# EAGLE design DOUBLE MOTOR 3 (EAGLE 6.6.0)
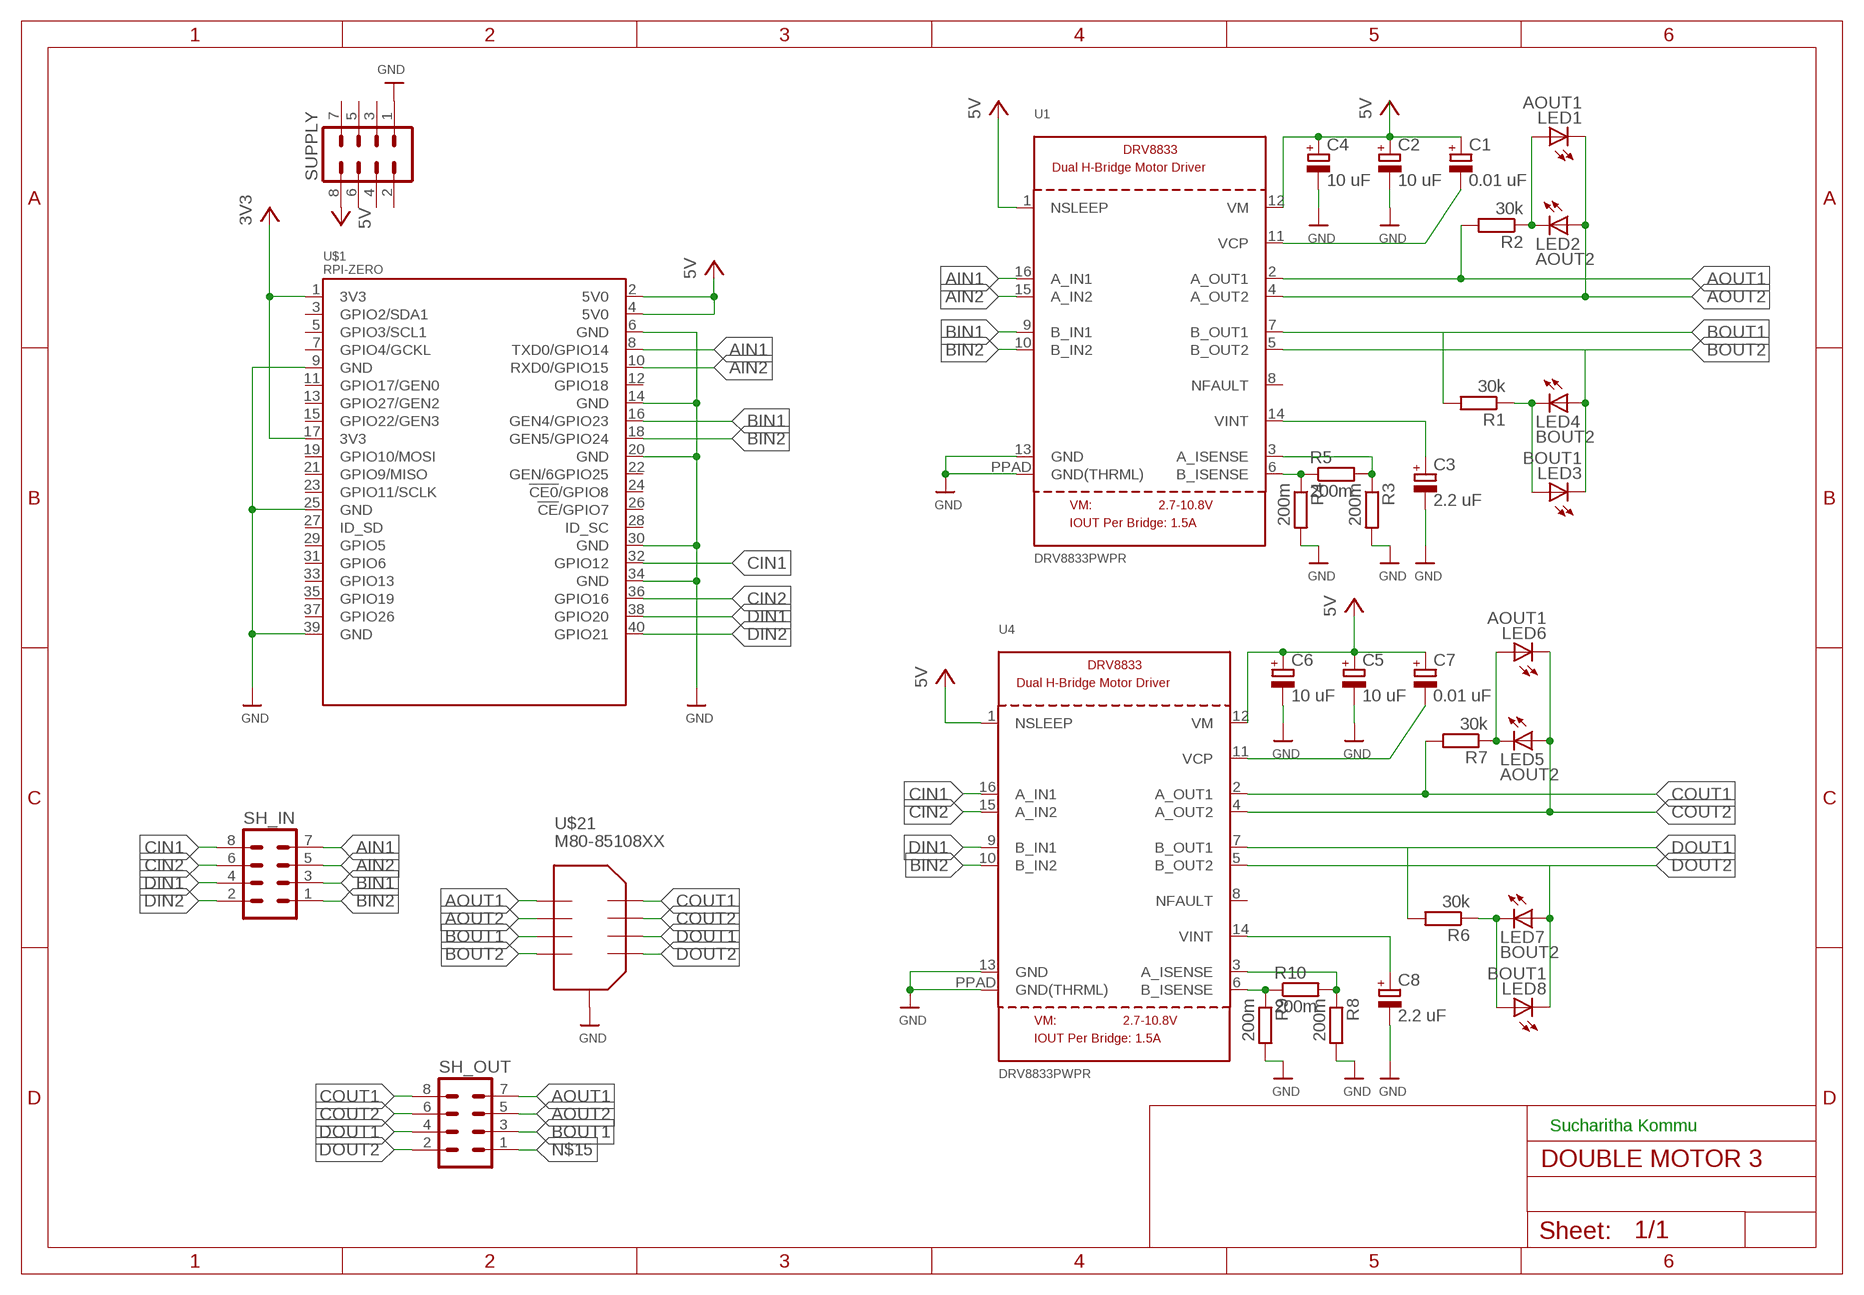
[diagram p0: schematic, sheet 1]

## Parts
C1  0.01 uF  CPOL-EUSMCC  [SMC_C]
C2  10 uF  CPOL-EUE2.5-6  [E2,5-6]
C3  2.2 uF  CPOL-EUSMCC  [SMC_C]
C4  10 uF  CPOL-EUE3.5-8  [E3,5-8]
C5  10 uF  CPOL-EUE2.5-6  [E2,5-6]
C6  10 uF  CPOL-EUE3.5-8  [E3,5-8]
C7  0.01 uF  CPOL-EUSMCC  [SMC_C]
C8  2.2 uF  CPOL-EUSMCC  [SMC_C]
LED1  AOUT1  LED5MM  [LED5MM]
LED2  AOUT2  LED5MM  [LED5MM]
LED3  BOUT1  LED5MM  [LED5MM]
LED4  BOUT2  LED5MM  [LED5MM]
LED5  AOUT2  LED5MM  [LED5MM]
LED6  AOUT1  LED5MM  [LED5MM]
LED7  BOUT2  LED5MM  [LED5MM]
LED8  BOUT1  LED5MM  [LED5MM]
R1  30k  R-EU_0204/2V  [0204V]
R2  30k  R-EU_0204/2V  [0204V]
R3  200m  R-EU_0204/2V  [0204V]
R4  200m  R-EU_0204/2V  [0204V]
R5  200m  R-EU_0204/2V  [0204V]
R6  30k  R-EU_0204/2V  [0204V]
R7  30k  R-EU_0204/2V  [0204V]
R8  200m  R-EU_0204/2V  [0204V]
R9  200m  R-EU_0204/2V  [0204V]
R10  200m  R-EU_0204/2V  [0204V]
SH_IN  MA04-2  [MA04-2]
SH_OUT  MA04-2  [MA04-2]
SUPPLY  MA04-2  [MA04-2]
U1  DRV8833PWPR  DRV8833  [HTSSOP16]
U4  DRV8833PWPR  DRV8833  [HTSSOP16]
U$1  RPI-ZERO  [RASPBERRYPI_BASTELSTUBE_V13_RASPI_BOARD_B+_FULL]
U$21  M80-85108XX  [M80-85108XX]

## Nets
3V3: U$1.1(3V3) U$1.17(3V3)
5V: U$1.2(5V0) U$1.4(5V0)
AIN1: SH_IN.7 U1.16(A_IN1) U$1.8(TXD0/GPIO14)
AIN2: SH_IN.5 U1.15(A_IN2) U$1.10(RXD0/GPIO15)
AOUT1: R2.2 SH_OUT.7 U1.2(A_OUT1) U$21.P$5
AOUT2: LED1.K(C) LED2.A SH_OUT.5 U1.4(A_OUT2) U$21.P$7
BIN1: SH_IN.3 U1.9(B_IN1) U$1.16(GEN4/GPIO23)
BIN2: SH_IN.1 U1.10(B_IN2) U4.10(B_IN2) U$1.18(GEN5/GPIO24)
BOUT1: R1.2 SH_OUT.3 U1.7(B_OUT1) U$21.P$9
BOUT2: LED3.K(C) LED4.A U1.5(B_OUT2) U$21.P$11
CIN1: SH_IN.8 U4.16(A_IN1) U$1.32(GPIO12)
CIN2: SH_IN.6 U4.15(A_IN2) U$1.36(GPIO16)
COUT1: R7.2 SH_OUT.8 U4.2(A_OUT1) U$21.P$6
COUT2: LED5.A LED6.K(C) SH_OUT.6 U4.4(A_OUT2) U$21.P$8
DIN1: SH_IN.4 U4.9(B_IN1) U$1.38(GPIO20)
DIN2: SH_IN.2 U$1.40(GPIO21)
DOUT1: R6.2 SH_OUT.4 U4.7(B_OUT1) U$21.P$10
DOUT2: LED7.A LED8.K(C) SH_OUT.2 U4.5(B_OUT2) U$21.P$12
GND: C1.- C2.- C3.- C4.- C5.- C6.- C7.- C8.- R3.2 R4.2 R8.2 R9.2 SUPPLY.1 U1.11(VCP) U1.13(GND) U1.PPAD(GND(THRML)) U4.11(VCP) U4.13(GND) U4.PPAD(GND(THRML)) U$1.6(GND) U$1.9(GND) U$1.14(GND) U$1.20(GND) U$1.25(GND) U$1.30(GND) U$1.34(GND) U$1.39(GND) U$21.COMMON1(COMMON) U$21.COMMON2(COMMON) U$21.COMMON3(COMMON) U$21.COMMON4(COMMON)
N$1: LED7.K(C) LED8.A R6.1
N$2: LED5.K(C) LED6.A R7.1
N$3: R8.1 R10.2 U4.3(A_ISENSE)
N$4: C8.+ U4.14(VINT)
N$5: LED1.A LED2.K(C) R2.1
N$6: R9.1 R10.1 U4.6(B_ISENSE)
N$7: LED3.A LED4.K(C) R1.1
N$11: C3.+ U1.14(VINT)
N$12: R3.1 R5.2 U1.3(A_ISENSE)
N$13: R4.1 R5.1 U1.6(B_ISENSE)
N$15: SH_OUT.1
VCC: C1.+ C2.+ C4.+ C5.+ C6.+ C7.+ SUPPLY.8 U1.1(NSLEEP) U1.12(VM) U4.1(NSLEEP) U4.12(VM) ; supply symbol labelled 5V
Unconnected: SUPPLY.2 SUPPLY.3 SUPPLY.4 SUPPLY.5 SUPPLY.6 SUPPLY.7 U1.8(NFAULT) U4.8(NFAULT) U$1.3(GPIO2/SDA1) U$1.5(GPIO3/SCL1) U$1.7(GPIO4/GCKL) U$1.11(GPIO17/GEN0) U$1.12(GPIO18) U$1.13(GPIO27/GEN2) U$1.15(GPIO22/GEN3) U$1.19(GPIO10/MOSI) U$1.21(GPIO9/MISO) U$1.22(GEN/6GPIO25) U$1.23(GPIO11/SCLK) U$1.24(!CE0!/GPIO8) U$1.26(!CE!/GPIO7) U$1.27(ID_SD) U$1.28(ID_SC) U$1.29(GPIO5) U$1.31(GPIO6) U$1.33(GPIO13) U$1.35(GPIO19) U$1.37(GPIO26)

## Notes on the sheet
- Sucharitha Kommu

## Library data of the parts
C1 C3 C7 C8 = resistor:CPOL-EU: POLARIZED CAPACITOR, European symbol
C2 C4-C6 = rcl:CPOL-EU: POLARIZED CAPACITOR, European symbol
LED1-LED8 = led:LED: LED OSRAM: - CHIPLED LG R971, LG N971, LY N971, LG Q971, LY Q971, LO R971, LY R971 LH N974, LH R974 LS Q976, LO Q976, LY Q976 LO Q996 - Hyper CHIPLED LW Q18S LB Q993, LB Q99A, LB R99A - SideLED LS A670, LO A670, LY A670, LG A670, LP A670 LB A673, LV A673, LT A673, LW A673 LH A674 LY A675 LS A676, LA A676, LO A676, LY A676, LW A676 LS A679, LY A679, LG A679 - Hyper Micro SIDELED® LS Y876, LA Y876, LO Y876, LY Y876 LT Y87S - SmartLED LW L88C, LW L88S LB L89C, LB L89S, LG L890 LS L89K, LO L89K, LY L89K LS L896, LA L896, LO L896, LY L896 - TOPLED LS T670, LO T670, LY T670, LG T670, LP T670 LSG T670, LSP T670, LSY T670, LOP T670, LYG T670 LG T671, LOG T671, LSG T671 LB T673, LV T673, LT T673, LW T673 LH T674 LS T676, LA T676, LO T676, LY T676, LB T676, LH T676, LSB T676, LW T676 LB T67C, LV T67C, LT T67C, LS T67K, LO T67K, LY T67K, LW E67C LS E67B, LA E67B, LO E67B, LY E67B, LB E67C, LV E67C, LT E67C LW T67C LS T679, LY T679, LG T679 LS T770, LO T770, LY T770, LG T770, LP T770 LB T773, LV T773, LT T773, LW T773 LH T774 LS E675, LA E675, LY E675, LS T675 LS T776, LA T776, LO T776, LY T776, LB T776 LHGB T686 LT T68C, LB T68C - Hyper Mini TOPLED® LB M676 - Mini TOPLED Santana® LG M470 LS M47K, LO M47K, LY M47K Source: http://www.osram.convergy.de LUXEON: - LUMILED® LXK2-PW12-R00, LXK2-PW12-S00, LXK2-PW14-U00, LXK2-PW14-V00 LXK2-PM12-R00, LXK2-PM12-S00, LXK2-PM14-U00 LXK2-PE12-Q00, LXK2-PE12-R00, LXK2-PE12-S00, LXK2-PE14-T00, LXK2-PE14-U00 LXK2-PB12-K00, LXK2-PB12-L00, LXK2-PB12-M00, LXK2-PB14-N00, LXK2-PB14-P00, LXK2-PB14-Q00 LXK2-PR12-L00, LXK2-PR12-M00, LXK2-PR14-Q00, LXK2-PR14-R00 LXK2-PD12-Q00, LXK2-PD12-R00, LXK2-PD12-S00 LXK2-PH12-R00, LXK2-PH12-S00 LXK2-PL12-P00, LXK2-PL12-Q00, LXK2-PL12-R00 Source: www.luxeon.com KINGBRIGHT: KA-3528ASYC Source: www.kingbright.com
R1-R10 = rcl:R-EU_: RESISTOR, European symbol
SH_IN SH_OUT SUPPLY = con-lstb:MA04-2: PIN HEADER; OC_FARNELL: unknown; OC_NEWARK: unknown
U1 U4 = microbuilder:DRV8833: DRV8833 Dual H-Bridge Motor Driver -- HTSSOP Package
U$1 = RPI-Zero:RPI-ZERO
U$21 = Harwin:M80-85108XX

## Board
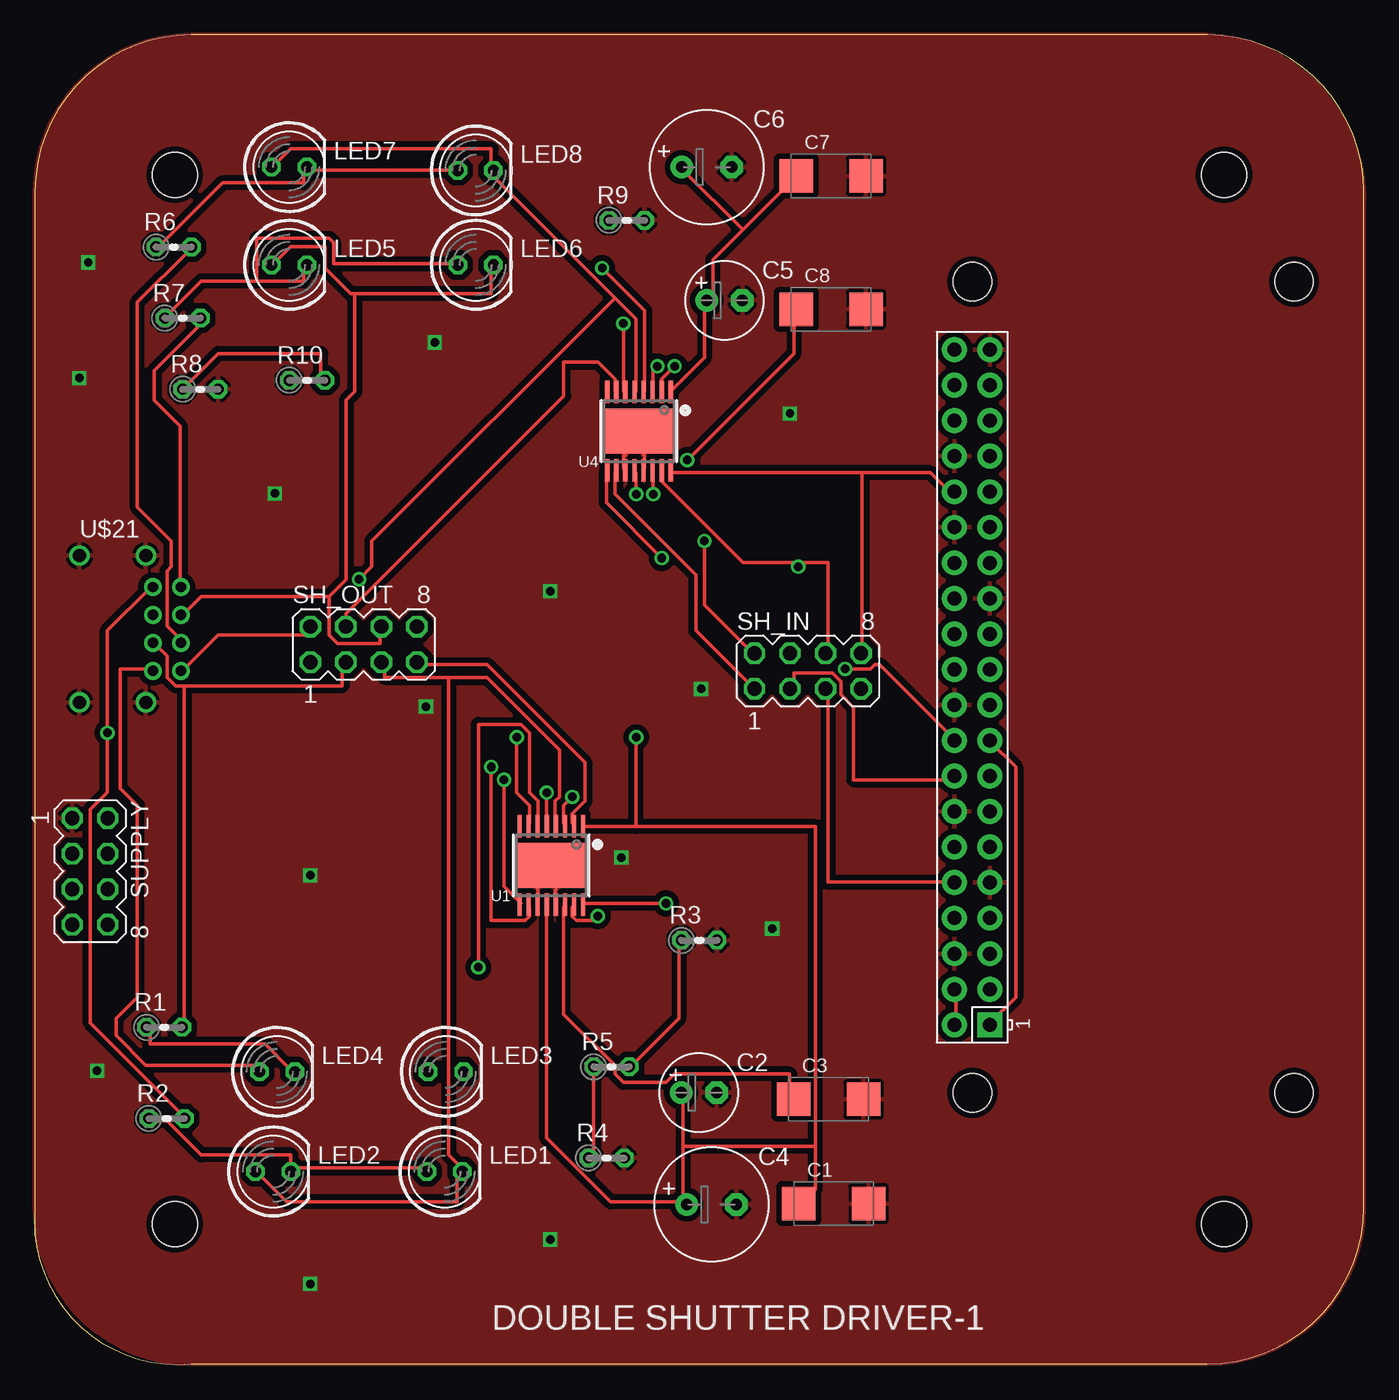
[diagram p1: board, top side]
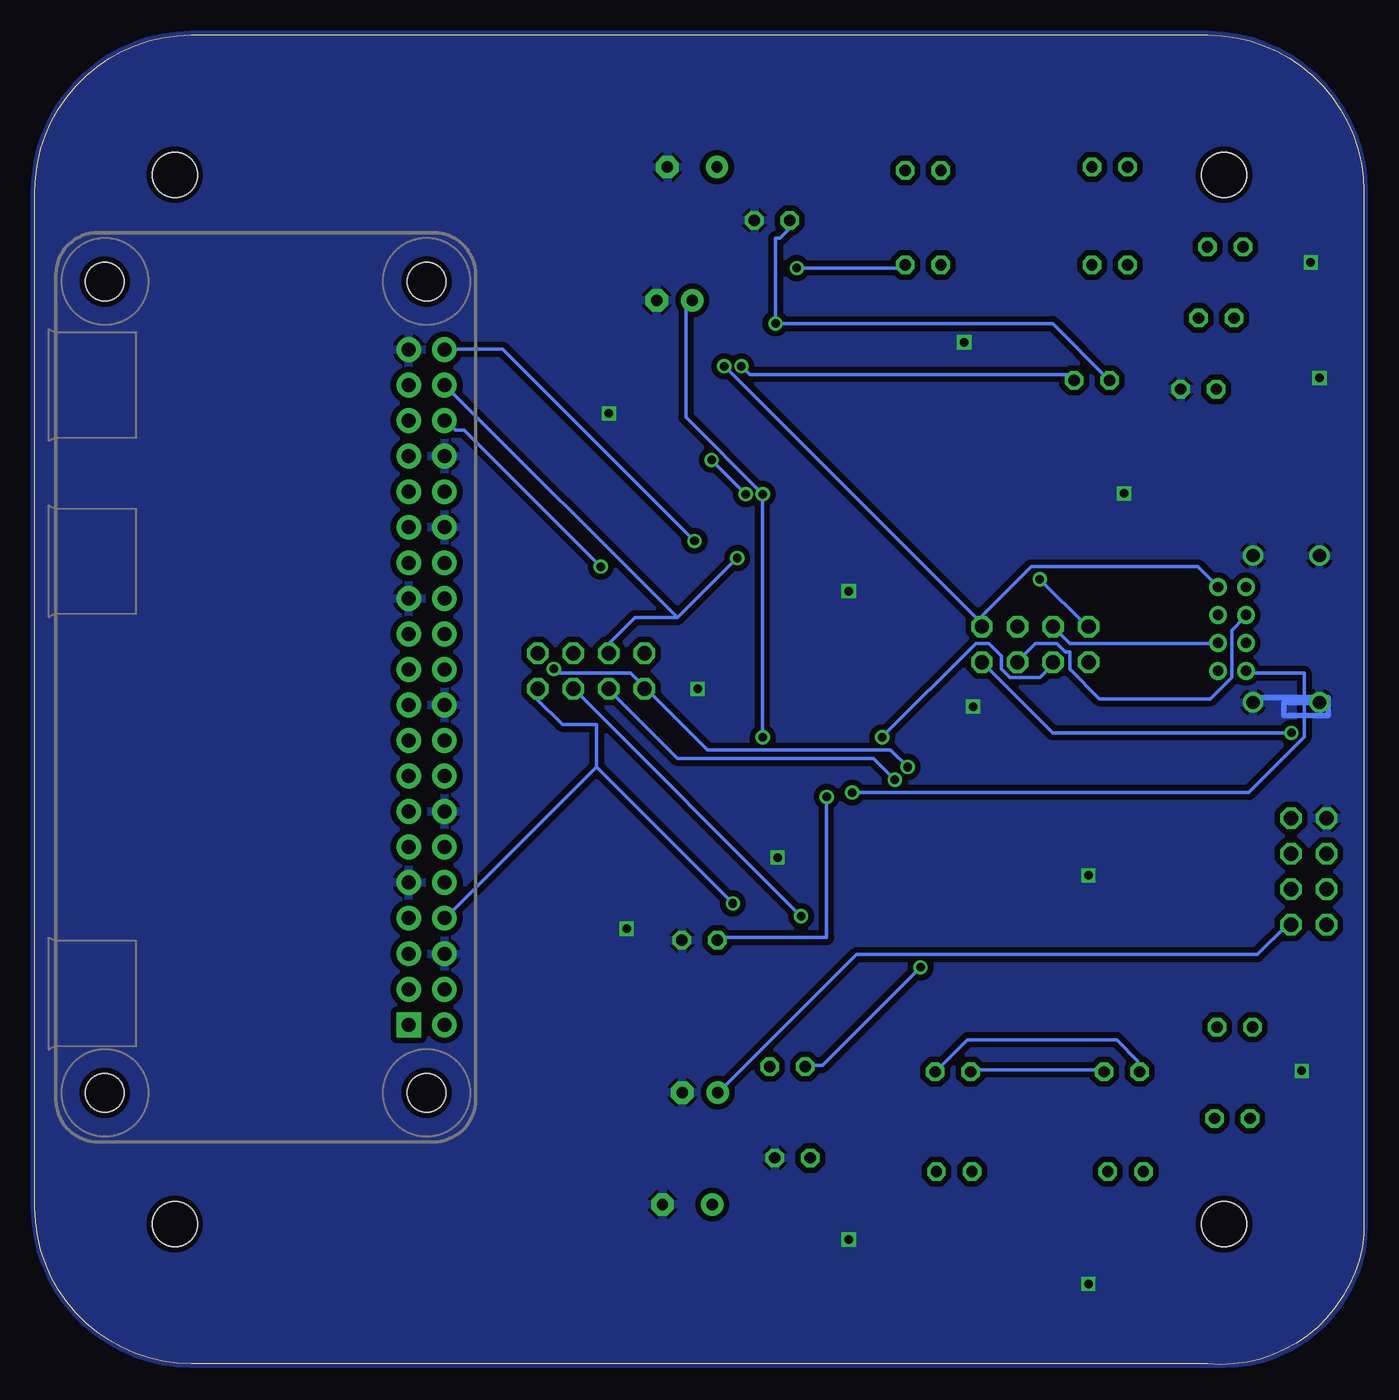
[diagram p2: board, bottom side, seen from below]

Size 95 x 95.04 mm. Coordinates in mm from the lower left corner, seen from the top.
Outline: 83.82,95.04 11.18,95.04 arc90 0,83.86 0,9.32 arc90 11.18,0.04 83.82,0.04 arc90 95,11.22 95,83.86 arc90 83.82,95.04
Copper layers (1*16): Top 0.035mm / dielectric 1.5mm / Bottom 0.035mm
Design rules "default *": minimum track width 10mil, minimum drill 24mil, track to track 8mil, track to pad 8mil, pad to pad 8mil, via to via 8mil, smd to smd 8mil, copper to edge 0mil, drill to drill 8mil, minimum pad ring 10mil, minimum via ring 8mil, stop-mask expansion 4mil, vias tented up to drill 0mil, thermal gap 10mil
Holes 3.2 mm at 10,85.04 10,10.04 85,10.04 85,85.04

### Footprints (pad centres in the part's own frame; a part is rotated, then mirrored left to right if it is on the bottom)
SMC_C = smd 2.4 x 2.4: + -2.5,0; - 2.5,0
E2,5-6 = drill 0.813 pad 1.6: + -1.27,0 | drill 0.813 pad 1.6 octagon: - 1.27,0
E3,5-8 = drill 0.813 pad 1.6: + -1.778,0 | drill 0.813 pad 1.6 octagon: - 1.778,0
LED5MM = drill 0.813 octagon: A -1.27,0; K 1.27,0
0204V = drill 0.813 octagon: 1 -1.27,0; 2 1.27,0
MA04-2 = drill 1.016 octagon: 1 -3.81,-1.27; 2 -3.81,1.27; 3 -1.27,-1.27; 4 -1.27,1.27; 5 1.27,-1.27; 6 1.27,1.27; 7 3.81,-1.27; 8 3.81,1.27
HTSSOP16 = smd 0.3 x 1.6: 1 -2.275,-2.8; 2 -1.625,-2.8; 3 -0.975,-2.8; 4 -0.325,-2.8; 5 0.325,-2.8; 6 0.975,-2.8; 7 1.625,-2.8; 8 2.275,-2.8; 9 2.275,2.8; 10 1.625,2.8; 11 0.975,2.8; 12 0.325,2.8; 13 -0.325,2.8; 14 -0.975,2.8; 15 -1.625,2.8; 16 -2.275,2.8 | smd 4.8 x 3.2: PPAD 0,0
RASPBERRYPI_BASTELSTUBE_V13_RASPI_BOARD_B+_FULL = drill 1 pad 1.778 square: 1 8.37,25.23 | drill 1 pad 1.778: 2 8.37,27.77; 3 10.91,25.23; 4 10.91,27.77; 5 13.45,25.23; 6 13.45,27.77; 7 15.99,25.23; 8 15.99,27.77; 9 18.53,25.23; 10 18.53,27.77; 11 21.07,25.23; 12 21.07,27.77; 13 23.61,25.23; 14 23.61,27.77; 15 26.15,25.23; 16 26.15,27.77; 17 28.69,25.23; 18 28.69,27.77; 19 31.23,25.23; 20 31.23,27.77; 21 33.77,25.23; 22 33.77,27.77; 23 36.31,25.23; 24 36.31,27.77; 25 38.85,25.23; 26 38.85,27.77; 27 41.39,25.23; 28 41.39,27.77; 29 43.93,25.23; 30 43.93,27.77; 31 46.47,25.23; 32 46.47,27.77; 33 49.01,25.23; 34 49.01,27.77; 35 51.55,25.23; 36 51.55,27.77; 37 54.09,25.23; 38 54.09,27.77; 39 56.63,25.23; 40 56.63,27.77 | hole 2.75: 3.5,3.5; 3.5,26.5; 61.5,3.5; 61.5,26.5
M80-85108XX = drill 0.95: COMMON1 0,0; COMMON2 0,4.75; COMMON3 10.5,0; COMMON4 10.5,4.75 | drill 0.75: P$5 2.25,5.25; P$6 2.25,7.25; P$7 4.25,5.25; P$8 4.25,7.25; P$9 6.25,5.25; P$10 6.25,7.25; P$11 8.25,5.25; P$12 8.25,7.25

### Placement (x,y rotation side)
C1  57.09,11.5 0 top
C2  47.46,19.44 0 top
C3  56.73,18.96 0 top
C4  48.37,11.44 0 top
C5  49.29,76.07 0 top
C6  48.02,85.6 0 top
C7  56.91,84.96 0 top
C8  56.91,75.44 0 top
LED1  29.29,13.8 0 top
LED2  17.04,13.8 0 top
LED3  29.37,20.92 0 top
LED4  17.3,20.92 0 top
LED5  18.18,78.61 0 top
LED6  31.51,78.61 0 top
LED7  18.18,85.6 0 top
LED8  31.51,85.36 0 top
R1  9.24,24.11 0 top
R2  9.41,17.59 0 top
R3  47.48,30.33 0 top
R4  40.84,14.77 0 top
R5  41.21,21.28 0 top
R6  9.92,79.88 0 top
R7  10.55,74.8 0 top
R8  11.82,69.72 0 top
R9  42.3,81.79 0 top
R10  19.45,70.36 0 top
SH_IN  55.24,49.57 0 top
SH_OUT  23.5,51.48 0 top
SUPPLY  3.94,35.25 270 top
U1  36.91,35.68 180 top
U4  43.18,66.72 180 top
U$1  93.5,15.92 90 top
U$21  3.17,57.83 270 top

### Tracks (layer width: path | path; a pad name or v marks a point on that pad's centre or on a via)
3V3
  Top 0.254: U$1.1 68.28,24.43 70.1,26.26 70.1,42.72 68.28,44.55 U$1.17
5V
  Top 0.254: U$1.2 65.84,24.43 65.84,26.56 U$1.4
AIN1  (via drill 0.61)
  Top 0.254: v45.11,32.96 39.32,32.96 U1.16
  Bottom 0.254: 54.86,42.72 65.53,32.05 U$1.8 | 54.86,42.72 54.86,45.76 57.3,45.76 59.13,47.59 59.13,48.2 SH_IN.7 | 54.86,42.72 v45.11,32.96
AIN2  (via drill 0.61)
  Top 0.254: v40.23,32.05 40.23,31.74 38.71,31.74 38.41,32.05 38.41,32.66 U1.15 | U$1.10 65.53,34.49 56.69,34.49 56.69,48.2 SH_IN.5
  Bottom 0.254: v40.23,32.05 56.39,48.2 SH_IN.5
AOUT1  (via drill 0.61)
  Top 0.254: U$21.P$5 8.23,55.52 5.18,52.47 v5.18,45.15 5.18,40.89 3.96,39.67 3.96,24.43 10.67,17.72 R2.2 | U1.2 38.41,38.75 38.41,39.36 39.32,40.28 39.32,43.02 32.31,50.03 27.43,50.03 SH_OUT.7
  Bottom 0.254: SH_OUT.7 22.25,45.15 v5.18,45.15
AOUT2
  Top 0.254: LED2.A 15.85,13.76 17.98,11.63 30.18,11.63 30.18,13.46 30.48,13.76 LED1.K 30.48,14.07 29.57,14.98 29.57,49.12 | 29.57,49.12 24.99,49.12 24.99,50.03 SH_OUT.5 | 29.57,49.12 32.31,49.12 37.49,43.94 37.49,40.58 37.19,40.28 37.19,38.75 U1.4
  Bottom 0.254: U$21.P$7 8.53,53.38 9.45,52.47 9.45,49.12 10.97,47.59 18.9,47.59 21.03,49.73 21.03,50.95 21.34,50.95 21.95,51.56 23.47,51.56 24.69,50.34 SH_OUT.5
BIN1  (via drill 0.61)
  Top 0.254: U$1.16 65.53,41.8 58.52,41.8 58.52,46.98 57.61,47.9 57.61,48.81 57,49.42 54.25,49.42 54.25,48.51 SH_IN.3 | v33.53,41.8 33.53,34.18 34.75,32.96 U1.9
  Bottom 0.254: v33.53,41.8 35.05,43.33 49.07,43.33 53.95,48.2 SH_IN.3
BIN2  (via drill 0.61)
  Top 0.254: v32.61,42.72 32.61,31.74 35.05,31.74 35.36,32.05 35.36,32.66 U1.10 | U4.10 41.45,63.75 41.45,62.22 47.24,56.43 47.24,52.47 51.21,48.51 SH_IN.1 | v57.91,49.73 59.74,49.73 60.05,50.03 60.35,50.03 65.53,44.85 U$1.18
  Bottom 0.254: v32.61,42.72 33.83,43.94 46.94,43.94 51.21,48.2 SH_IN.1 51.51,48.51 52.43,49.42 57.61,49.42 v57.91,49.73
BOUT1  (via drill 0.61)
  Top 0.254: v34.44,44.85 34.44,40.89 35.36,39.97 35.36,38.75 U1.7 | 10.67,48.51 21.95,48.51 21.95,50.03 SH_OUT.3 | 10.67,48.51 10.06,48.51 9.45,49.12 9.45,50.64 8.53,51.56 U$21.P$9 | 10.67,48.51 10.67,24.12 R1.2
  Bottom 0.254: v34.44,44.85 27.74,51.56 26.82,51.56 25.91,50.64 25.91,49.73 25.3,49.12 23.16,49.12 22.25,50.03 SH_OUT.3
BOUT2  (via drill 0.61)
  Top 0.254: U$21.P$11 8.23,49.73 6.1,49.73 6.1,41.19 7.32,39.97 7.32,26.26 5.79,24.73 5.79,23.51 7.92,21.38 15.85,21.38 15.85,21.08 LED4.A | v36.58,40.89 36.58,38.75 U1.5
  Bottom 0.254: LED3.K 30.48,21.08 28.35,23.21 17.68,23.21 16.15,21.69 16.15,21.08 LED4.A | v36.58,40.89 8.23,40.89 4.27,44.85 4.27,49.42 8.23,49.42 U$21.P$11
CIN1
  Top 0.254: 59.13,63.75 64.01,63.75 65.53,62.22 U$1.32 | 59.13,63.75 45.41,63.75 U4.16 | 59.13,63.75 59.13,50.95 SH_IN.8
CIN2  (via drill 0.61)
  Top 0.254: 54.56,57.35 56.69,57.35 56.69,50.95 SH_IN.6 | 54.56,57.35 50.6,57.35 44.81,63.14 44.81,63.75 U4.15 | 54.56,57.35 v54.56,57.04
  Bottom 0.254: v54.56,57.04 64.31,66.8 64.92,66.8 65.53,67.41 U$1.36
COUT1  (via drill 0.61)
  Top 0.254: U$21.P$6 10.36,55.82 10.36,67.1 8.53,68.93 8.53,71.06 11.58,74.11 11.58,74.72 R7.2 | v45.72,71.37 44.81,70.45 44.81,69.54 U4.2
  Bottom 0.254: 27.74,53.38 27.13,52.77 SH_OUT.8 27.74,53.38 | 27.74,53.38 v45.72,71.37 | 27.74,53.38 27.43,53.38 23.77,57.04 11.89,57.04 10.67,55.82 U$21.P$6
COUT2  (via drill 0.61)
  Top 0.254: 21.03,54.91 11.89,54.91 10.67,53.69 U$21.P$8 | 21.03,54.91 21.03,52.17 21.64,51.56 24.69,51.56 24.69,52.47 SH_OUT.6 | v40.54,78.38 43.59,75.33 43.59,69.54 U4.4 | 22.86,76.55 32.61,76.55 32.61,78.38 LED6.K | 22.86,76.55 22.55,76.55 20.73,78.38 20.73,79.9 18.29,79.9 17.07,78.68 LED5.A | 21.03,54.91 22.25,56.13 22.25,68.93 22.86,69.54 22.86,76.55
  Bottom 0.254: v40.54,78.38 32.92,78.38 LED6.K
DIN1  (via drill 0.61)
  Top 0.254: v44.81,57.65 40.84,61.61 40.84,63.75 U4.9
  Bottom 0.254: 49.07,53.38 v44.81,57.65 | 49.07,53.38 52.12,53.38 53.95,51.56 53.95,50.95 SH_IN.4 | 49.07,53.38 65.53,69.84 U$1.38
DIN2  (via drill 0.61)
  Top 0.254: v47.85,58.87 47.85,54.3 51.21,50.95 SH_IN.2
  Bottom 0.254: v47.85,58.87 61.57,72.59 65.53,72.59 U$1.40
DOUT1
  Top 0.254: U4.7 41.45,69.54 41.45,70.45 40.23,71.67 37.8,71.67 37.8,69.23 22.25,53.69 22.25,52.77 SH_OUT.4 | R6.2 10.97,79.6 7.32,75.94 7.32,61.31 9.75,58.87 9.75,57.04 9.45,56.74 9.45,52.77 10.36,51.86 U$21.P$10
  Bottom 0.254: SH_OUT.4 21.03,51.56 10.67,51.56 U$21.P$10
DOUT2  (via drill 0.61)
  Top 0.254: LED7.A 17.07,85.69 18.29,86.91 32.61,86.91 32.61,85.39 LED8.K 32.92,85.08 32.92,84.78 41.45,76.24 | U$21.P$12 10.67,49.73 13.11,52.17 19.51,52.17 19.51,52.47 SH_OUT.2 | 41.45,76.24 42.98,74.72 42.98,69.54 U4.5 | v23.16,56.13 24.08,57.04 24.08,58.87 41.45,76.24
  Bottom 0.254: v23.16,56.13 19.81,52.77 SH_OUT.2
GND  (via drill 0.6)
  Top 0.254: U1.11 35.97,32.96 35.97,33.88 35.94,33.97 | U1.13 37.19,32.96 37.19,33.88 37.23,33.97 | U4.11 42.06,64.05 42.06,64.97 42.2,65.01 | U4.13 43.59,64.05 43.59,64.97 43.51,65.01
  Bottom 0.406: U$21.COMMON3 5.71,47.33 5.71,46.4 2.54,46.4 2.54,47.67 7.92,47.67 U$21.COMMON4
  other vias: 19.68,5.76 36.83,8.93 3.81,78.78 3.17,70.53 4.45,21 19.68,34.97 27.94,47.03 36.83,55.29 53.98,67.99 52.7,31.16 17.14,62.27 41.91,36.24 47.62,48.3 28.57,73.07
  pour Bottom (isolate 0.406): 0,83.86 0,11.22 arc90 11.18,0.04 83.82,0.04 arc90 95,11.22 95,83.86 arc90 83.82,95.04 11.18,95.04 arc90
  pour Bottom (isolate 0.406): 0,83.86 0,10.04 arc90 10,0.04 83.82,0.04 arc90 95,11.22 95,83.86 arc90 83.82,95.04 11.18,95.04 arc90
  pour Top (isolate 0.406): 0,83.86 0,11.22 arc90 11.18,0.04 83.82,0.04 arc90 95,11.22 95,82.59 arc90 83.82,95.04 11.18,95.04 arc90
N$1
  Top 0.254: R6.1 8.84,79.9 13.41,84.47 19.2,84.47 19.2,85.39 LED7.K 19.51,85.39 30.18,85.39 LED8.A
N$2
  Top 0.254: 15.85,77.46 19.2,77.46 19.2,78.38 LED5.K | 15.85,77.46 11.89,77.46 9.45,75.03 R7.1 | 15.85,77.46 15.85,80.51 21.03,80.51 21.34,80.21 21.34,78.68 30.18,78.68 LED6.A
N$3  (via drill 0.61)
  Top 0.254: v44.5,71.37 44.2,71.06 44.2,69.54 U4.3 | R8.1 10.67,69.84 13.11,72.28 20.42,72.28 20.42,70.45 R10.2
  Bottom 0.254: v44.5,71.37 43.89,70.76 21.03,70.76 20.73,70.45 R10.2
N$4  (via drill 0.61)
  Top 0.254: v44.2,62.22 44.2,63.75 U4.14 | v46.63,64.66 54.25,72.28 54.25,75.33 C8.+
  Bottom 0.254: v46.63,64.66 v44.2,62.22
N$5
  Top 0.254: R2.1 8.23,17.42 9.45,17.42 11.89,14.98 18.29,14.98 18.29,14.07 LED2.K 18.59,14.07 27.74,14.07 LED1.A
N$6  (via drill 0.61)
  Top 0.254: v42.06,74.42 42.06,69.54 U4.6
  Bottom 0.254: R9.1 41.15,81.73 41.15,81.12 41.76,80.51 42.06,80.51 v42.06,74.42 22.25,74.42 18.29,70.45 R10.1
N$7
  Top 0.254: LED4.K 18.29,21.08 16.46,22.9 8.23,22.9 8.23,23.82 R1.1
  Bottom 0.254: LED3.A 28.04,21.08 18.59,21.08 LED4.K
N$11
  Top 0.254: U1.14 37.8,32.66 37.8,25.04 41.45,21.38 41.45,20.77 42.06,20.16 45.11,20.16 45.72,20.77 53.95,20.77 53.95,19.25 C3.+
N$12  (via drill 0.61)
  Top 0.254: v38.41,40.58 37.8,39.97 37.8,38.75 U1.3 | R5.2 42.67,21.38 46.02,24.73 46.02,30.22 R3.1
  Bottom 0.254: v38.41,40.58 38.41,30.52 46.02,30.52 R3.1
N$13  (via drill 0.61)
  Top 0.254: U1.6 35.97,38.75 35.97,40.28 35.36,40.89 35.36,45.15 34.75,45.76 31.7,45.76 v31.7,28.39 | R4.1 39.62,14.98 39.93,15.28 39.93,21.08 R5.1
  Bottom 0.254: v31.7,28.39 38.71,21.38 39.93,21.38 R5.1
VCC  (via drill 0.61)
  Top 0.254: 50.6,81.12 48.46,78.99 48.46,76.55 48.16,76.24 C5.+ 47.85,75.94 47.85,71.98 45.41,69.54 U4.1 | 50.6,81.12 54.25,84.78 C7.+ | 50.6,81.12 46.33,85.39 C6.+ | 46.33,11.63 41.15,11.63 36.58,16.2 36.58,32.66 U1.12 | 46.33,15.59 46.33,19.25 C2.+ | 46.33,15.59 46.33,11.63 | 46.33,11.63 C4.+ | v42.98,62.22 42.98,63.75 U4.12 | 42.98,38.45 55.78,38.45 55.78,15.59 | 42.98,38.45 39.32,38.45 U1.1 | 55.78,15.59 55.78,12.54 54.86,11.63 C1.+ | 42.98,38.45 v42.98,44.85 | 55.78,15.59 46.33,15.59
  Bottom 0.254: SUPPLY.8 5.49,31.44 7.62,29.31 36.27,29.31 46.02,19.55 C2.+ | C5.+ 48.16,75.94 48.46,75.94 48.46,67.71 v42.98,62.22 v42.98,44.85

### Text on the board
tPlace: DOUBLE SHUTTER DRIVER-1